# Altium project Tracker_PCB.PrjPcb
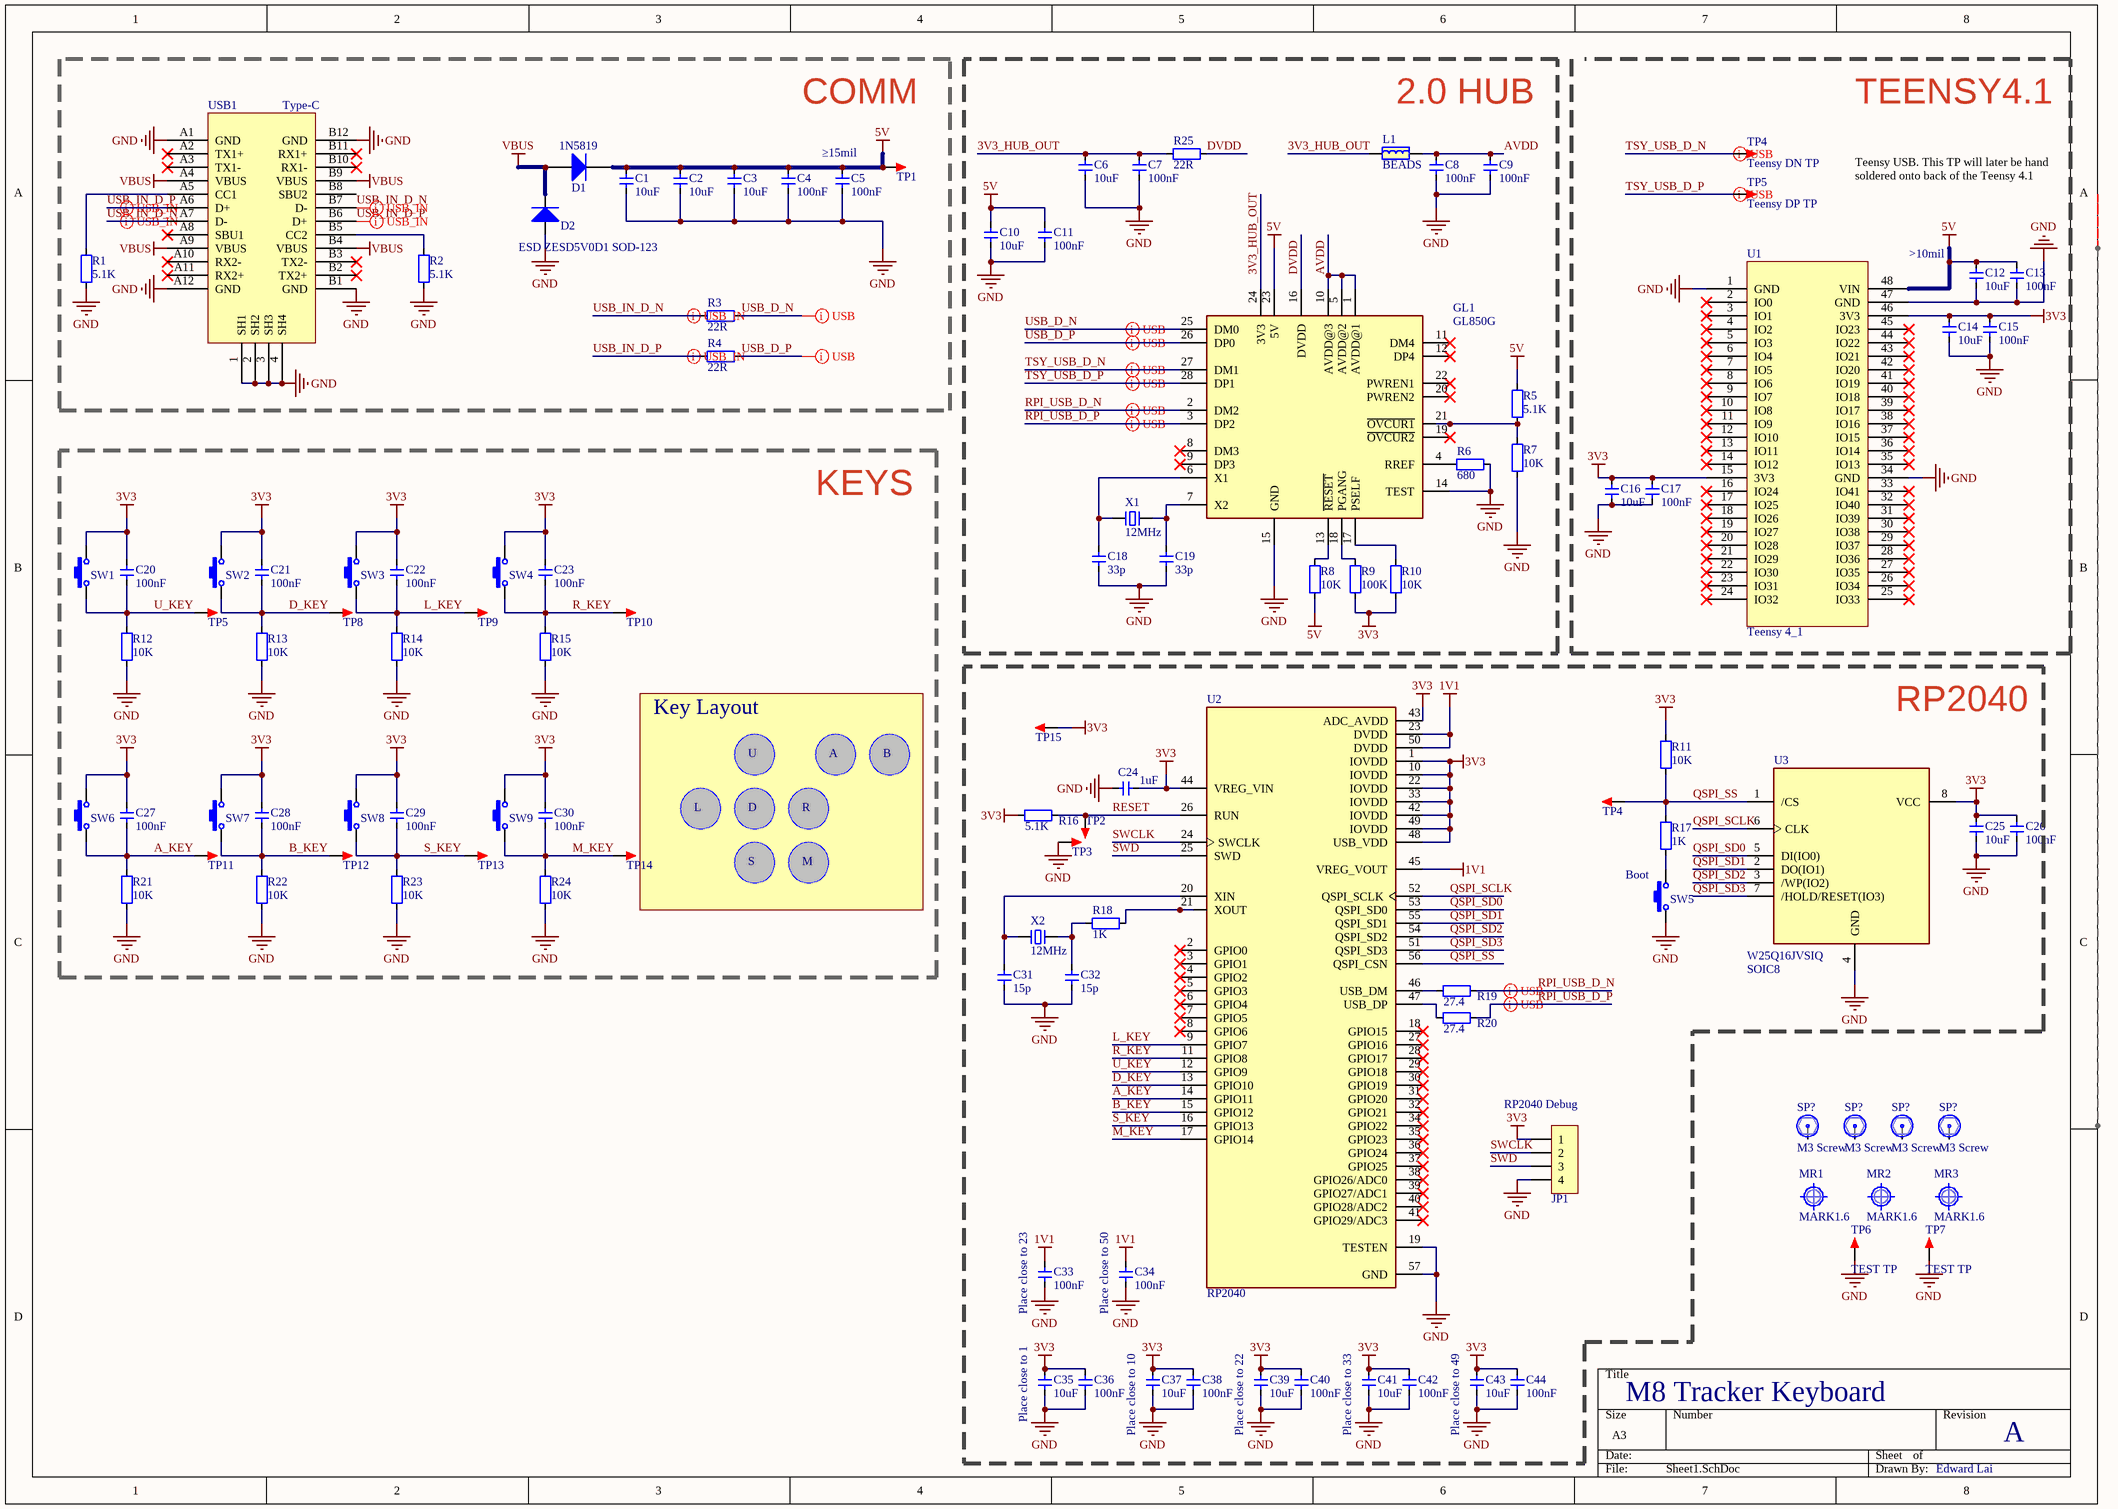
[diagram p0: Sheet1.SchDoc]
1 sheet, 113 parts. Net scope: global (net labels, ports and power ports of the same name join across sheets).
Board file: PCB1.PcbDoc

## Sheet Sheet1.SchDoc
size A3

### Parts
(Parts that share a designator on the sheet are numbered #1, #2 ... from top to bottom, then left to right.)
C1  10uF  [C0603_M]
C2  10uF  [C0603_M]
C3  10uF  [C0603_M]
C4  100nF  [C0603_M]
C5  100nF  [C0603_M]
C6  10uF  [C0603_M]
C7  100nF  [C0603_M]
C8  100nF  [C0603_M]
C9  100nF  [C0603_M]
C10  10uF  [C0603_M]
C11  100nF  [C0603_M]
C12  10uF  [C0603_M]
C13  100nF  [C0603_M]
C14  10uF  [C0603_M]
C15  100nF  [C0603_M]
C16  10uF  [C0603_M]
C17  100nF  [C0603_M]
C18  33p  [C0603_M]
C19  33p  [C0603_M]
C20  100nF  [C0603_M]
C21  100nF  [C0603_M]
C22  100nF  [C0603_M]
C23  100nF  [C0603_M]
C24  1uF  [C0603_M]
C25  10uF  [C0603_M]
C26  100nF  [C0603_M]
C27  100nF  [C0603_M]
C28  100nF  [C0603_M]
C29  100nF  [C0603_M]
C30  100nF  [C0603_M]
C31  15p  [C0603_M]
C32  15p  [C0603_M]
C33  100nF  [C0603_M]
C34  100nF  [C0603_M]
C35  10uF  [C0603_M]
C36  100nF  [C0603_M]
C37  10uF  [C0603_M]
C38  100nF  [C0603_M]
C39  10uF  [C0603_M]
C40  100nF  [C0603_M]
C41  10uF  [C0603_M]
C42  100nF  [C0603_M]
C43  10uF  [C0603_M]
C44  100nF  [C0603_M]
D1  1N5819  [SOD-323]
D2  ESD ZESD5V0D1 SOD-123  [SOD-123]
GL1  GL850G  [SSOP28]
JP1  CON-4P  [MX1.25-LS-4P]  (value not drawn)  (net tie, no BOM)
L1  BEADS  [L0603]
MR1  MARK1.6  [Mark 1.6]  (no BOM)
MR2  MARK1.6  [Mark 1.6]  (no BOM)
MR3  MARK1.6  [Mark 1.6]  (no BOM)
R1  5.1K  [R0603_M]
R2  5.1K  [R0603_M]
R3  22R  [R0603_M]
R4  22R  [R0603_M]
R5  5.1K  [R0603_M]
R6  680  [R0603_M]
R7  10K  [R0603_M]
R8  10K  [R0603_M]
R9  100K  [R0603_M]
R10  10K  [R0603_M]
R11  10K  [R0603_M]
R12  10K  [R0603_M]
R13  10K  [R0603_M]
R14  10K  [R0603_M]
R15  10K  [R0603_M]
R16  5.1K  [R0603_M]
R17  1K  [R0603_M]
R18  1K  [R0603_M]
R19  27.4  [R0603_M]
R20  27.4  [R0603_M]
R21  10K  [R0603_M]
R22  10K  [R0603_M]
R23  10K  [R0603_M]
R24  10K  [R0603_M]
R25  22R  [R0603_M]
SP?#1  M3 Screw  [M3x8_N]  (graphical)
SP?#2  M3 Screw  [M3x8_N]  (graphical)
SP?#3  M3 Screw  [M3x8_N]  (graphical)
SP?#4  M3 Screw  [M3x8_N]  (graphical)
SW1  Kailh 5118-Choc-Socket  [Kailh_socket_PG1350]  (value not drawn)
SW2  Kailh 5118-Choc-Socket  [Kailh_socket_PG1350]  (value not drawn)
SW3  Kailh 5118-Choc-Socket  [Kailh_socket_PG1350]  (value not drawn)
SW4  Kailh 5118-Choc-Socket  [Kailh_socket_PG1350]  (value not drawn)
SW5  3x8 Switch 2P  [TSW SMD-3*6*2.5]  (value not drawn)  (net tie, no BOM)
SW6  Kailh 5118-Choc-Socket  [Kailh_socket_PG1350]  (value not drawn)
SW7  Kailh 5118-Choc-Socket  [Kailh_socket_PG1350]  (value not drawn)
SW8  Kailh 5118-Choc-Socket  [Kailh_socket_PG1350]  (value not drawn)
SW9  Kailh 5118-Choc-Socket  [Kailh_socket_PG1350]  (value not drawn)
TP1  5V TP  [TEST 1.2]  (value not drawn)  (net tie, no BOM)
TP2  RST_TP  [TEST 1.2]  (value not drawn)  (net tie, no BOM)
TP3  GND_TP  [TEST 1.2]  (value not drawn)  (net tie, no BOM)
TP4#1  Teensy DN TP  [Solder-Pad]  (graphical)
TP4#2  RST_TP  [TEST 1.2]  (value not drawn)  (net tie, no BOM)
TP5#1  Teensy DP TP  [Solder-Pad]  (graphical)
TP5#2  TP  [TEST 1.2]  (value not drawn)  (net tie, no BOM)
TP6  TEST TP  [TEST 1.2]  (net tie, no BOM)
TP7  TEST TP  [TEST 1.2]  (net tie, no BOM)
TP8  TP  [TEST 1.2]  (value not drawn)  (net tie, no BOM)
TP9  TP  [TEST 1.2]  (value not drawn)  (net tie, no BOM)
TP10  TP  [TEST 1.2]  (value not drawn)  (net tie, no BOM)
TP11  TP  [TEST 1.2]  (value not drawn)  (net tie, no BOM)
TP12  TP  [TEST 1.2]  (value not drawn)  (net tie, no BOM)
TP13  TP  [TEST 1.2]  (value not drawn)  (net tie, no BOM)
TP14  TP  [TEST 1.2]  (value not drawn)  (net tie, no BOM)
TP15  TP  [TEST 1.2]  (value not drawn)  (net tie, no BOM)
U1  Teensy 4_1  [Teensy4_1_SMT_SOP48]
U2  RP2040  [QFN40P700X700X90-57N]
U3  W25Q16JVSIQ  fp: SOIC8  [SOIC-8W]
USB1  Type-C  [Type-C-TOP]
X1  12MHz  [XTAL-5032-2P]
X2  12MHz  [XTAL-5032-2P]

### Blocks framed on the sheet
COMM: C1-C5 D1 D2 R1-R4 TP1 USB1
2.0 HUB: C6-C11 C18 C19 GL1 L1 R5-R10 R25 X1
KEYS: C20-C23 C27-C30 R12-R15 R21-R24 SW1-SW4 SW6-SW9 TP5#2 TP8-TP14
RP2040: C24-C26 C31-C44 JP1 R11 R16-R20 SW5 TP2 TP3 TP4#2 TP15 U2 U3 X2

### Nets
1V1: C33.2 C34.2 U2.23(DVDD) U2.45(VREG_VOUT) U2.50(DVDD)
3V3: C14.2 C15.2 C16.2 C17.2 C20.2 C21.2 C22.2 C23.2 C24.1 C25.2 C26.2 C27.2 C28.2 C29.2 C30.2 C35.2 C36.2 C37.2 C38.2 C39.2 C40.2 C41.2 C42.2 C43.2 C44.2 JP1.1 R9.2 R10.2 R11.1 R16.1 SW1.2 SW2.2 SW3.2 SW4.2 SW6.2 SW7.2 SW8.2 SW9.2 TP15.1 U1.15(3V3) U1.46(3V3) U2.1(IOVDD) U2.10(IOVDD) U2.22(IOVDD) U2.33(IOVDD) U2.42(IOVDD) U2.43(ADC_AVDD) U2.44(VREG_VIN) U2.48(USB_VDD) U2.49(IOVDD) U3.8(VCC)
5V: C1.2 C2.2 C3.2 C4.2 C5.2 C10.2 C11.2 C12.2 C13.2 D1.2(K) GL1.23(5V) R5.2 R8.2 TP1.1 U1.48(VIN)
GND: C1.1 C2.1 C3.1 C4.1 C5.1 C6.1 C7.1 C8.1 C9.1 C10.1 C11.1 C12.1 C13.1 C14.1 C15.1 C16.1 C17.1 C18.1 C19.1 C24.2 C25.1 C26.1 C31.1 C32.1 C33.1 C34.1 C35.1 C36.1 C37.1 C38.1 C39.1 C40.1 C41.1 C42.1 C43.1 C44.1 D2.1(A) GL1.14(TEST) GL1.15(GND) JP1.4 R1.2 R2.2 R6.1 R7.2 R12.1 R13.1 R14.1 R15.1 R21.1 R22.1 R23.1 R24.1 SW5.1 TP3.1 TP6.1 TP7.1 U1.1(GND) U1.34(GND) U1.47(GND) U2.19(TESTEN) U2.57(GND) U3.4(GND) USB1.1(SH1) USB1.2(SH2) USB1.3(SH3) USB1.4(SH4) USB1.A1(GND) USB1.A12(GND) USB1.B1(GND) USB1.B12(GND)
VBUS: D1.1(A) D2.2(K) USB1.A4(VBUS) USB1.A9(VBUS) USB1.B4(VBUS) USB1.B9(VBUS)
3V3_HUB_OUT: C6.2 C7.2 GL1.24(3V3) L1.1 R25.1
A_KEY: C27.1 R21.2 SW6.1 TP11.1 U2.14(GPIO11)
AVDD: C8.2 C9.2 GL1.1(AVDD@1) GL1.5(AVDD@2) GL1.10(AVDD@3) L1.2
B_KEY: C28.1 R22.2 SW7.1 TP12.1 U2.15(GPIO12)
D_KEY: C21.1 R13.2 SW2.1 TP8.1 U2.13(GPIO10)
DVDD: GL1.16(DVDD) R25.2
L_KEY: C22.1 R14.2 SW3.1 TP9.1 U2.9(GPIO7)
M_KEY: C30.1 R24.2 SW9.1 TP14.1 U2.17(GPIO14)
QSPI_SCLK: U2.52(QSPI_SCLK) U3.6(CLK)
QSPI_SD0: U2.53(QSPI_SD0) U3.5(DI(IO0))
QSPI_SD1: U2.55(QSPI_SD1) U3.2(DO(IO1))
QSPI_SD2: U2.54(QSPI_SD2) U3.3(/WP(IO2))
QSPI_SD3: U2.51(QSPI_SD3) U3.7(/HOLD/RESET(IO3))
QSPI_SS: R11.2 R17.2 TP4#2.1 U2.56(QSPI_CSN) U3.1(/CS)
R_KEY: C23.1 R15.2 SW4.1 TP10.1 U2.11(GPIO8)
RESET: R16.2 TP2.1 U2.26(RUN)
RPI_USB_D_N: GL1.2(DM2) R19.2
RPI_USB_D_P: GL1.3(DP2) R20.2
S_KEY: C29.1 R23.2 SW8.1 TP13.1 U2.16(GPIO13)
SWCLK: JP1.2 U2.24(SWCLK)
SWD: JP1.3 U2.25(SWD)
TSY_USB_D_N: GL1.27(DM1) TP4#1.1
TSY_USB_D_P: GL1.28(DP1) TP5#1.1
U_KEY: C20.1 R12.2 SW1.1 TP5#2.1 U2.12(GPIO9)
USB_D_N: GL1.25(DM0) R3.1
USB_D_P: GL1.26(DP0) R4.1
USB_IN_D_N: R3.2 USB1.A7(D-) USB1.B7(D-)
USB_IN_D_P: R4.2 USB1.A6(D+) USB1.B6(D+)
NetC18_2: C18.2 GL1.6(X1) X1.1
NetC19_2: C19.2 GL1.7(X2) X1.2
NetC31_2: C31.2 U2.20(XIN) X2.1
NetC32_2: C32.2 R18.1 X2.2
NetGL1_4: GL1.4(RREF) R6.2
NetGL1_13: GL1.13(~{RESET}) R8.1
NetGL1_17: GL1.17(PSELF) R10.1
NetGL1_18: GL1.18(PGANG) R9.1
NetGL1_21: GL1.21(~{OVCUR1}) R5.1 R7.1
NetR1_1: R1.1 USB1.A5(CC1)
NetR2_1: R2.1 USB1.B5(CC2)
NetR17_1: R17.1 SW5.2
NetR18_2: R18.2 U2.21(XOUT)
NetR19_1: R19.1 U2.46(USB_DM)
NetR20_1: R20.1 U2.47(USB_DP)

Not connected (* = marked no-connect by the designer): GL1 8(DM3)* 9(DP3)* 11(DM4)* 12(DP4)* 19(~{OVCUR2})* 20(PWREN2)* 22(PWREN1)*; SP?#1 1; SP?#2 1; SP?#3 1; SP?#4 1; U1 2(IO0)* 3(IO1)* 4(IO2)* 5(IO3)* 6(IO4)* 7(IO5)* 8(IO6)* 9(IO7)* 10(IO8)* 11(IO9)* 12(IO10)* 13(IO11)* 14(IO12)* 16(IO24)* 17(IO25)* 18(IO26)* 19(IO27)* 20(IO28)* 21(IO29)* 22(IO30)* 23(IO31)* 24(IO32)* 25(IO33)* 26(IO34)* 27(IO35)* 28(IO36)* 29(IO37)* 30(IO38)* 31(IO39)* 32(IO40)* 33(IO41)* 35(IO13)* 36(IO14)* 37(IO15)* 38(IO16)* 39(IO17)* 40(IO18)* 41(IO19)* 42(IO20)* 43(IO21)* 44(IO22)* 45(IO23)*; U2 2(GPIO0)* 3(GPIO1)* 4(GPIO2)* 5(GPIO3)* 6(GPIO4)* 7(GPIO5)* 8(GPIO6)* 18(GPIO15)* 27(GPIO16)* 28(GPIO17)* 29(GPIO18)* 30(GPIO19)* 31(GPIO20)* 32(GPIO21)* 34(GPIO22)* 35(GPIO23)* 36(GPIO24)* 37(GPIO25)* 38(GPIO26/ADC0)* 39(GPIO27/ADC1)* 40(GPIO28/ADC2)* 41(GPIO29/ADC3)*; USB1 A2(TX1+)* A3(TX1-)* A8(SBU1)* A10(RX2-)* A11(RX2+)* B2(TX2+)* B3(TX2-)* B8(SBU2) B10(RX1-)* B11(RX1+)*

### Layout directives
differential pair: RPI_USB_D_N, RPI_USB_D_P, TSY_USB_D_N, TSY_USB_D_P, USB_D_N, USB_D_P, USB_IN_D_N, USB_IN_D_P

### Notes on the sheet
- TEENSY4.1
- (near C5) ≥15mil
- Teensy USB. This TP will later be hand soldered onto back of the Teensy 4.1
- >10mil
- Key Layout
- U
- A
- B
- L
- D
- R
- S
- M
- Boot
- (near JP1) RP2040 Debug
- (near C33) Place close to 23
- (near C34) Place close to 50
- (near C35) Place close to 1
- (near C37) Place close to 10
- (near C39) Place close to 22
- (near C41) Place close to 33
- (near C43) Place close to 49
- M8 Tracker Keyboard
- Edward Lai

### Library data of the parts
C1-C11 C18 C19 C25 C26 C31-C44 = 电容-1206: Capacitor; Value: 0.1u
C12-C17 C24 = 电容-1206: 0603 Capacitor; Value: 0.1u
C20-C23 C27-C30 = 电容-0402: 0603 Capacitor; Value: 0.1u
D1 = 二极管-5B5817WS
D2 = TVS: ESD Protection / ZN-SOD123 / DL21 5V6; 联系卖家，免费查找封装: 唯一出售店铺网址https://shop463601444.taobao.com; Code_JEDEC: DO-214-AB
GL1 = GL850G: Programmable Logic IC Development Tools; MF: Olimex Ltd.; SnapEDA_Link: https://www.snapeda.com/parts/GL850G/Olimex+LTD/view-part/?ref=snap; Package: None; Value: *; MP: GL850G; Check_prices: https://www.snapeda.com/parts/GL850G/Olimex+LTD/view-part/?ref=eda
JP1 = Header 4: 4P连接器; 联系卖家 免费查找封装: 唯一出售店铺网址https://shop463601444.taobao.com; 联系卖家 免费技术支持: 封装库来自淘宝卖家ID：黄晶宝石; BOM名称: 4P连接器
L1 = 电感-201612: BEADS 30R 0603
MR1-MR3 = MARK: 光学定位点; 联系卖家，免费查找封装: 唯一出售店铺网址https://shop463601444.taobao.com; 封装库来自淘宝卖家ID：黄晶宝石: 其他店铺购入均为盗版假冒封装库，请立即申请退款; BOM名称: 光学定位点
R1 R2 = 电阻-0402: Resistor; Value: 22R
R3 R4 = 电阻-0402: Resistor; Value: 22R
R5 R6 R17 = 电阻-0402: 0603 1% Resistor; Value: 22R
R7-R16 R18-R24 = 电阻-0402: 0603 Resistor; Value: 22R
R25 = 电阻-0402: 0603 Resistor; Value: 22R
SP?#1-SP?#4 = 铜柱大焊盘: 铜柱; 联系卖家，免费查找封装: 唯一出售店铺网址https://shop463601444.taobao.com; 封装库来自淘宝卖家ID：黄晶宝石: 其他店铺购入均为盗版假冒封装库，请立即申请退款; BOM名称: 铜柱
SW1-SW9 = SW 3x6: BOM名称: 3x6轻触开关; 联系卖家，免费查找封装: 唯一出售店铺网址https://shop463601444.taobao.com; 封装库来自淘宝卖家ID：黄晶宝石: 其他店铺购入均为盗版假冒封装库，请立即申请退款
TP1-TP3 TP4#1 TP4#2 TP5#1 TP6 TP7 = TEST TP: TP; BOM名称: 测试环; 联系卖家，免费查找封装: 唯一出售店铺网址https://shop463601444.taobao.com; 封装库来自淘宝卖家ID：黄晶宝石: 其他店铺购入均为盗版假冒封装库，请立即申请退款
TP5#2 TP8-TP15 = TEST TP: BOM名称: 测试环; 联系卖家，免费查找封装: 唯一出售店铺网址https://shop463601444.taobao.com; 封装库来自淘宝卖家ID：黄晶宝石: 其他店铺购入均为盗版假冒封装库，请立即申请退款
U1 = Teensy4_1: Teensy 4_1 MCU
U2 = RP2040: RP2040 chip for Raspberry Pi Pico - ARM® Cortex®-M0+ MCU 32-Bit; SnapEDA_Link: https://www.snapeda.com/parts/RP2040/Raspberry+Pi/view-part/?ref=snap; Package: None; Value: *; MF: Raspberry Pi; MP: RP2040; Check_prices: https://www.snapeda.com/parts/RP2040/Raspberry+Pi/view-part/?ref=eda
U3 = W25Q128JVSIQ: FLASH - NOR Memory IC 16Mb (2M x 8) SPI - Quad I/O, QPI, DTR 133 MHz 8-SOIC; MF: Winbond Electronics; Price: None; Purchase-URL: https://pricing.snapeda.com/search/part/W25Q128JVSIQ/?ref=eda; Check_prices: https://www.snapeda.com/parts/W25Q128JVSIQ/Winbond+Electronics/view-part/?ref=eda; Value: *; MP: W25Q128JVSIQ; Package: SOIC-8 Winbond; SnapEDA_Link: https://www.snapeda.com/parts/W25Q128JVSIQ/Winbond+Electronics/view-part/?ref=snap; Availability: In Stock
USB1 = USB-Type-C-TOP: 16P USB Type-C Connector
X1 X2 = XTAL-2P: 2P Crystal 12MHZ; BOM名称: 2脚无源脚晶振; 联系卖家，免费查找封装: 唯一出售店铺网址https://shop463601444.taobao.com; 封装库来自淘宝卖家ID：黄晶宝石: 让中国人都用上 黄晶宝石 的AD封装库